# Altium schematic sheet Air Control.SchDoc
size A
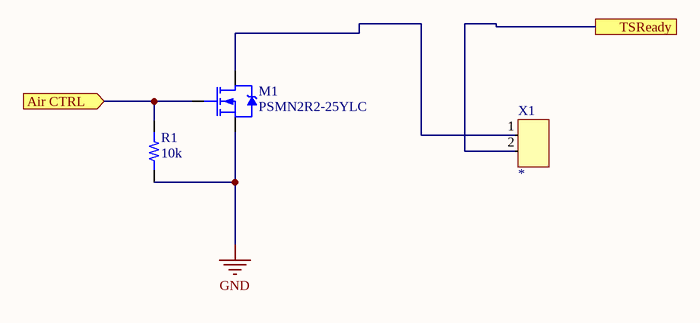
[diagram p0: Air Control.SchDoc]

## Parts
M1  PSMN2R2-25YLC  [POWER-SO8]
R1  10k  [RES 0603/1608]
X1  *  [CONN 43650-0200 MOLEX 2PIN]

## Ports
Air CTRL (in), TSReady

## Nets
GND: M1.S(Source) R1.1
Air CTRL: M1.G(Gate) R1.2 ; port Air CTRL
TSReady: X1.2 ; port TSReady
NetM1_D: M1.D(Drain) X1.1

## Library data of the parts
M1 = 3: N-Channel 25V 100A (Tc) 106W (Tc) Surface Mount LFPAK56, Power-SO8; id: 3; vdsmax: 0; numcircuits: 1; rdson: 2.5mOhm; vt: 4.5; vgsmax: 20; MfrPartNo: *; name: PSMN2R2-25YLC; type: N_Channel; current: 100A; package: LFPAK56; quantity: 0; link: https://www.digikey.com/product-detail/en/nexperia-usa-inc/PSMN2R2-25YLC115/1727-5299-1-ND/2674299
R1 = 1: id: 1; name: 0603 Resistor; percent tolerance: 5; resistance: 10k; package: 0603; quantity: 0
X1 = 9: Molex 43650_0200; id: 9; name: 0436500200; numcontacts: 2; numrows: 1; pitch: 3 mm; MfrPartNo: *; quantity: 0; link: https://www.digikey.com/product-detail/en/molex-llc/0436500200/WM1860-ND/268989